# EAGLE design 2 Motors (EAGLE 9.6.2)
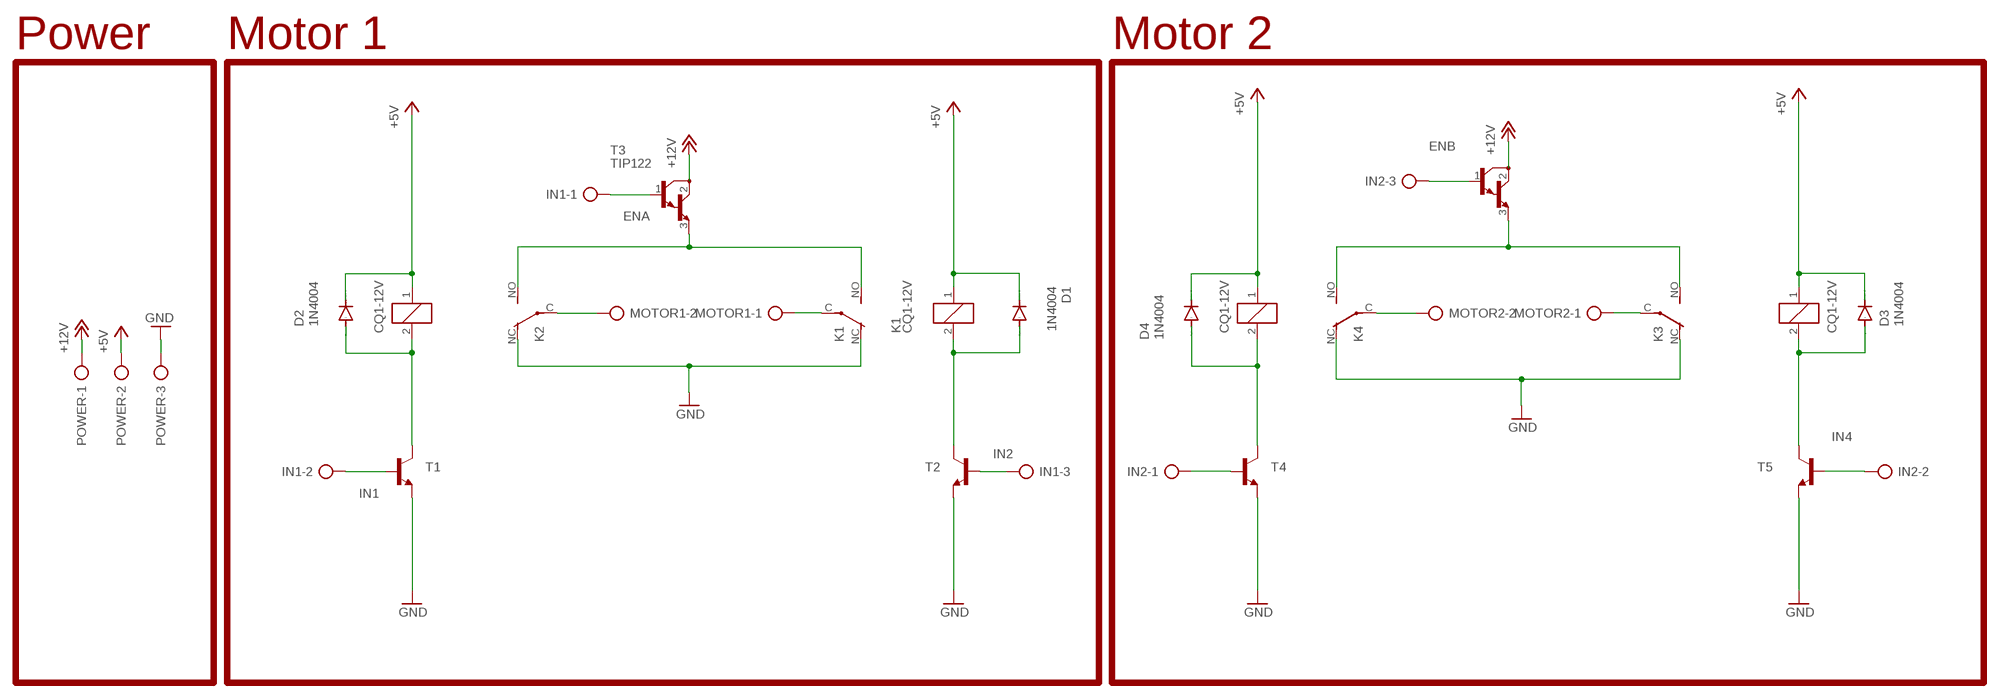
[diagram p0: schematic, sheet 1]

## Parts
D1  1N4004  [DO41-10]
D2  1N4004  [DO41-10]
D3  1N4004  [DO41-10]
D4  1N4004  [DO41-10]
IN1  AK300/3  [AK300/3]
IN2  AK300/3  [AK300/3]
K1  CQ1-12V  [CQ1]
K2  CQ1-12V  [CQ1]
K3  CQ1-12V  [CQ1]
K4  CQ1-12V  [CQ1]
MOTOR1  AK300/2  [AK300/2]
MOTOR2  AK300/2  [AK300/2]
POWER  AK300/3  [AK300/3]
T1  2N2222-NPN-TO92-EBC  [TO92-EBC]
T2  2N2222-NPN-TO92-EBC  [TO92-EBC]
T3  TIP122  [TO220]
T4  2N2222-NPN-TO92-EBC  [TO92-EBC]
T5  2N2222-NPN-TO92-EBC  [TO92-EBC]
T6  TIP122  [TO220]

## Nets
+5V: D1.C D2.C D3.C D4.C K1.1 K2.1 K3.1 K4.1 POWER.2
+12V: POWER.1 T3.2(C) T6.2(C)
ENA: IN1.1 T3.1(B)
ENB: IN2.3 T6.1(B)
GND: K1.NC(2:O) K2.NC(2:O) K3.NC(2:O) K4.NC(2:O) POWER.3 T1.E T2.E T4.E T5.E
IN1: IN1.2 T1.B
IN2: IN1.3 T2.B
IN3: IN2.1 T4.B
IN4: IN2.2 T5.B
N$1: K2.C(2:P) MOTOR1.2
N$2: K1.NO(2:S) K2.NO(2:S) T3.3(E)
N$3: D2.A K2.2 T1.C
N$5: K1.C(2:P) MOTOR1.1
N$6: D1.A K1.2 T2.C
N$7: D3.A K3.2 T5.C
N$8: K3.NO(2:S) K4.NO(2:S) T6.3(E)
N$9: D4.A K4.2 T4.C
N$14: K3.C(2:P) MOTOR2.1
N$16: K4.C(2:P) MOTOR2.2

## Notes on the sheet
- Power | Motor 1 | Motor 2

## Library data of the parts
D1-D4 = diode:1N4004: DIODE general purpose rectifier, 1 A
IN1 IN2 POWER = con-ptr500:AK300/3: CONNECTOR; OC_FARNELL: unknown; OC_NEWARK: unknown
K1-K4 = relay:CQ1-12V: AUTOMOTIVE QUIET RELAY NAiS Source: http://www.mew-europe.com/.. en_ds_61208_0000.pdf; OC_FARNELL: unknown; OC_NEWARK: unknown
MOTOR1 MOTOR2 = con-ptr500:AK300/2: CONNECTOR; OC_FARNELL: unknown; OC_NEWARK: unknown
T1 T2 T4 T5 = transistor-neu-to92:*-NPN-: NPN Transistror
T3 T6 = transistor:TIP122: NPN BIPOLAR DARLINGTON TRANSISTOR

## Board
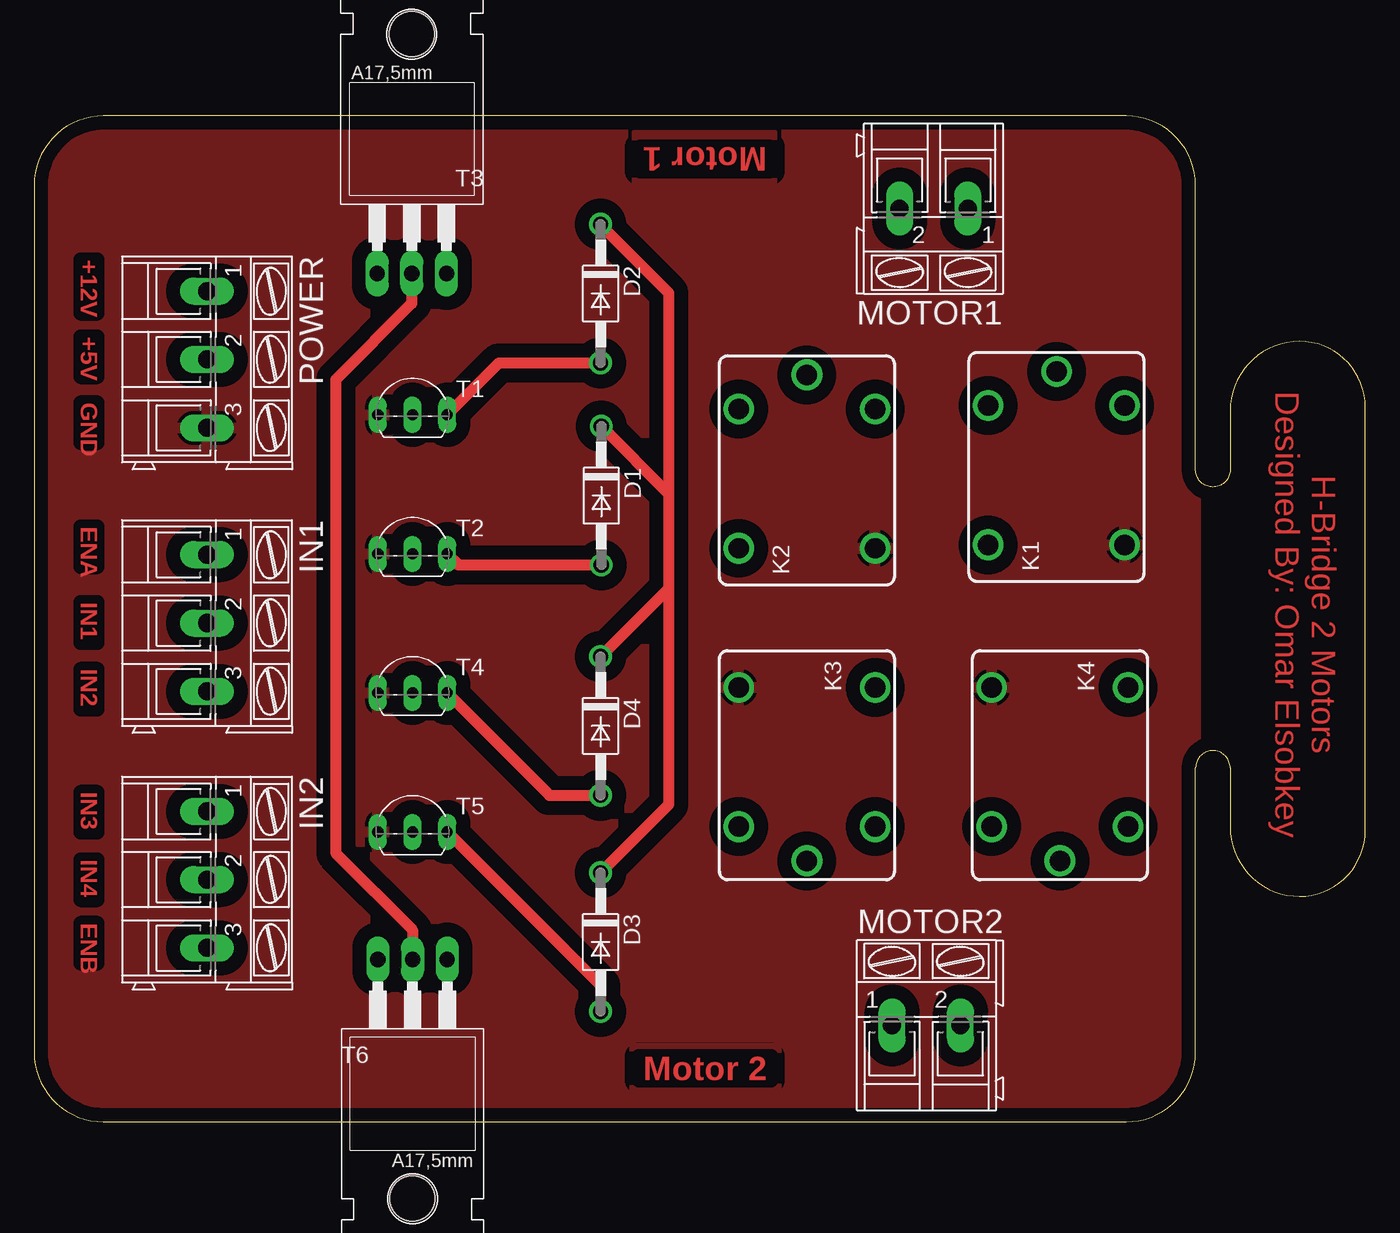
[diagram p1: board, top side]
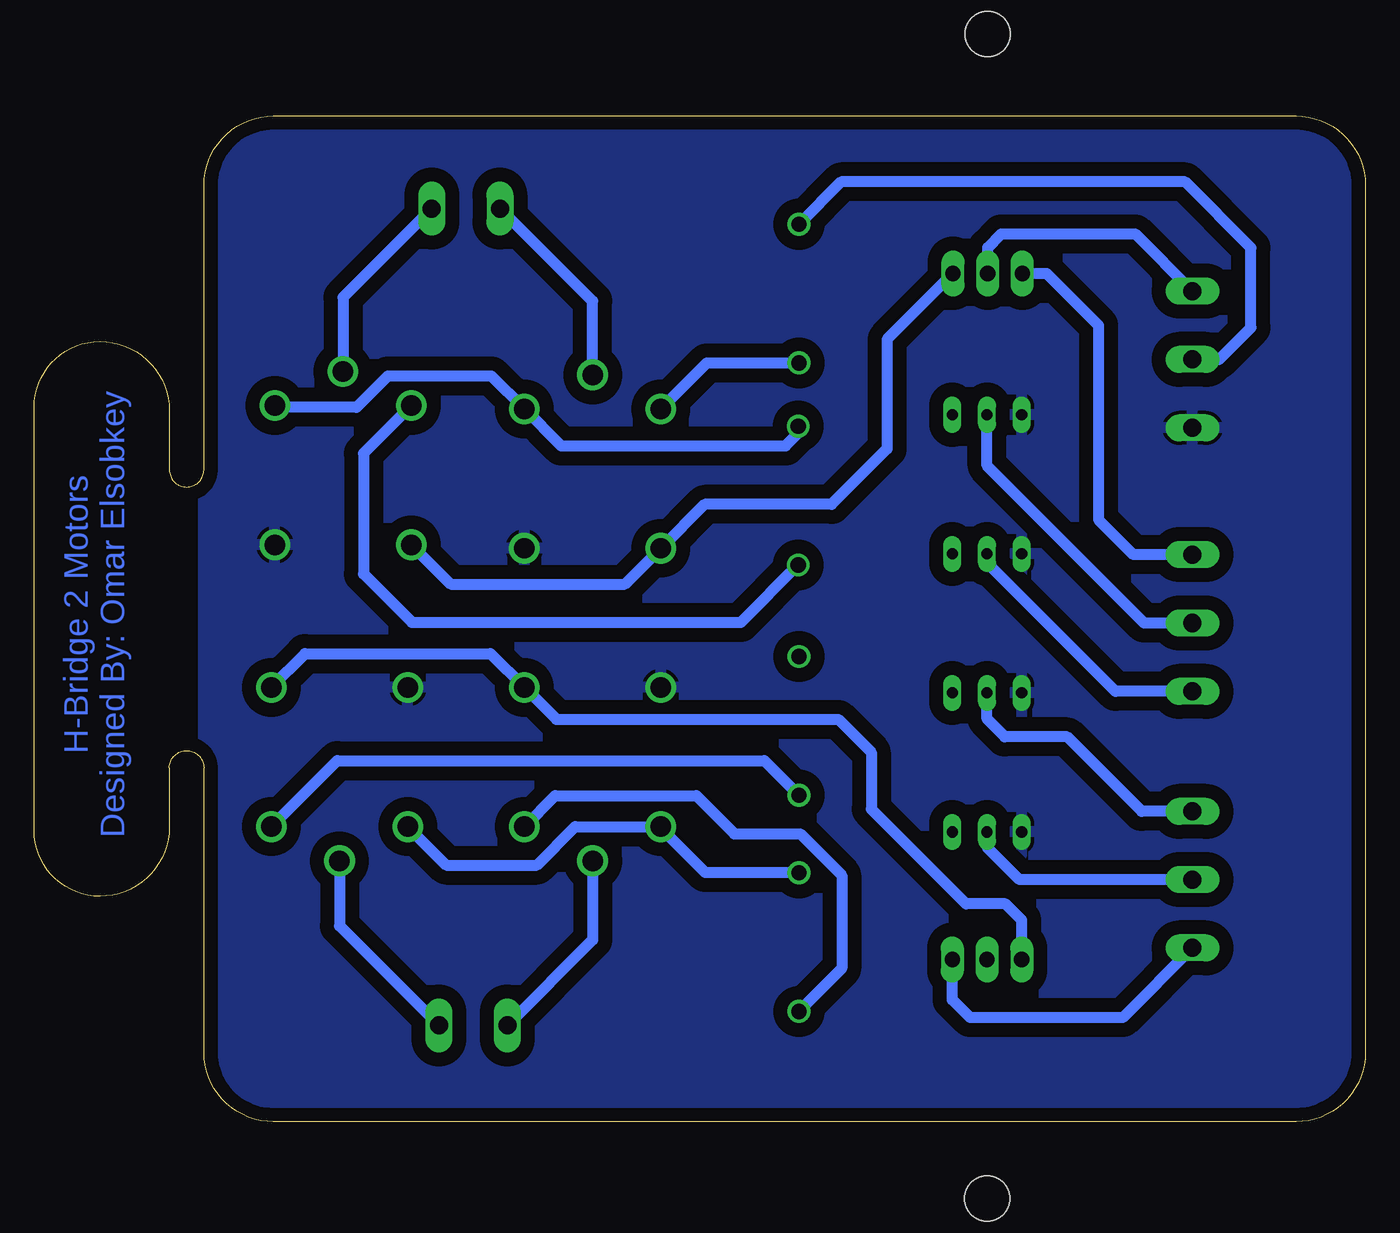
[diagram p2: board, bottom side, seen from below]

Size 97.54 x 73.66 mm. Coordinates in mm from the lower left corner, seen from the top.
Outline: 92.71,16.51 arc90 97.54,21.34 97.54,52.32 arc90 92.71,57.15 arc90 87.63,52.07 87.63,47.75 arc-90 86.36,46.48 arc-90 85.09,47.75 85.09,68.58 arc90 80.01,73.66 5.08,73.66 arc90 0,68.58 0,5.08 arc90 5.08,0 80.01,0 arc90 85.09,5.08 85.09,25.91 arc-90 86.36,27.18 arc-90 87.63,25.91 87.63,21.59 arc90 92.71,16.51
Copper layers (1*16): Top 0.035mm / dielectric 1.5mm / Bottom 0.035mm
Design rules "default *": minimum track width 32mil, minimum drill 0.35mm, track to track 16mil, track to pad 16mil, pad to pad 6mil, via to via 6mil, smd to smd 6mil, copper to edge 40mil, drill to drill 6mil, minimum pad ring 10mil, minimum via ring 8mil, stop-mask expansion 4mil, vias tented up to drill 0mil, thermal gap 10mil

### Footprints (pad centres in the part's own frame; a part is rotated, then mirrored left to right if it is on the bottom)
DO41-10 = drill 1.118: A 5.08,0; C -5.08,0
AK300/3 = drill 1.321 long: 1 -5.004,0; 2 0,0; 3 5.004,0
CQ1 = drill 1.5: 1 4.5,-5; 2 4.5,5; C 7,0; NC -5.7,-5; NO -5.7,5
AK300/2 = drill 1.321 long: 1 -2.515,0; 2 2.489,0
TO92-EBC = drill 0.813 long: B 0,-1.27; C 2.54,-1.27; E -2.54,-1.27
TO220 = drill 1.118 long: 1 -2.54,-6.35; 2 0,-6.35; 3 2.54,-6.35 | hole 3.302: 0,11.176

### Placement (x,y rotation side)
D1  41.55,45.86 270 top
D2  41.5,60.66 270 top
D3  41.5,13.16 270 top
D4  41.5,28.99 270 top
IN1  12.67,36.53 270 top
IN2  12.67,17.73 270 top
K1  74.9,47.96 90 top
K2  56.62,47.7 90 top
K3  56.62,26.11 270 top
K4  75.16,26.11 270 top
MOTOR1  65.89,66.88 180 top
MOTOR2  65.38,7.06 0 top
POWER  12.67,55.83 270 top
T1  27.72,53.05 0 top
T2  27.72,42.86 0 top
T3  27.67,68.48 0 top
T4  27.72,32.68 0 top
T5  27.72,22.49 0 top
T6  27.72,5.54 180 top

### Tracks (layer width: path | path; a pad name or v marks a point on that pad's centre or on a via)
+5V
  Top 0.813: D2.C 41.5,65.68 46.48,60.71 46.48,46.01 | 46.48,46.01 46.48,39.05 | 46.48,39.05 46.48,23.22 D3.C | D1.C 46.48,46.01 | D4.C 46.48,39.05
  Bottom 0.813: D1.C 41.55,50.43 42.48,49.5 58.92,49.5 K2.1 64.03,54.61 71.63,54.61 73.91,52.32 79.77,52.32 K1.1 | K4.1 67.34,18.8 60.71,18.8 57.89,21.61 K3.1 51.62,21.49 48.36,18.24 D3.C | POWER.2 10.72,55.83 8.38,58.17 8.38,64.01 13.21,68.83 38.41,68.83 D2.C
+12V
  Top 0.813: T3.2 27.67,59.93 22.1,54.36 22.1,19.67 27.72,14.04 T6.2
  Bottom 0.813: T3.2 27.67,64.02 26.67,65.02 16.87,65.02 POWER.1
ENA
  Bottom 0.813: T3.1 23.36,62.13 19.56,58.33 19.56,44.09 16.99,41.53 IN1.1
ENB
  Bottom 0.813: IN2.3 17.78,7.62 28.96,7.62 30.26,8.93 T6.1
GND
  pour Bottom (isolate 1.016): -2.26,74.96 85.14,74.96 85.14,-1.96 -2.26,-1.96
  pour Top (isolate 1.016): -0.84,73.91 85.09,73.91 85.09,-1.4 -0.84,-1.4
IN1
  Bottom 0.813: IN1.2 16.2,36.52 27.72,48.04 T1.B
IN2
  Bottom 0.813: IN1.3 18.31,31.52 27.72,40.93 T2.B
IN3
  Bottom 0.813: IN2.1 16.38,22.73 21.84,28.19 26.42,28.19 27.72,29.5 T4.B
IN4
  Bottom 0.813: IN2.2 25.35,17.73 27.72,20.1 T5.B
N$1
  Bottom 0.813: K2.C 56.62,60.1 MOTOR1.2
N$2
  Bottom 0.813: K1.NO 67.02,39.37 54.25,39.37 K2.NO 48.41,45.21 39.12,45.21 35.05,49.28 35.05,57.29 T3.3
N$3
  Top 0.813: T1.C 34.06,55.58 D2.A
  Bottom 0.813: K2.2 48.24,55.58 D2.A
N$5
  Bottom 0.813: MOTOR1.1 74.91,60.38 K1.C
N$6
  Top 0.813: T2.C 31.08,40.77 D1.A
  Bottom 0.813: K1.2 73.41,48.95 73.41,40.13 69.85,36.58 45.75,36.58 D1.A
N$7
  Top 0.813: T5.C 41.5,9.98 D3.A
  Bottom 0.813: K3.2 59.35,23.88 49.02,23.88 46.23,21.08 41.4,21.08 38.35,18.03 38.35,11.23 D3.A
N$8
  Bottom 0.813: K4.NO 77.68,34.29 64.09,34.29 K3.NO 59.27,29.46 38.61,29.46 36.2,27.05 36.2,22.9 29.25,15.96 26.37,15.96 25.18,14.77 T6.3
N$9
  Top 0.813: T4.C 37.76,23.91 D4.A
  Bottom 0.813: K4.2 75.32,26.45 44.04,26.45 D4.A
N$14
  Bottom 0.813: K3.C 56.62,13.31 MOTOR2.1
N$16
  Bottom 0.813: K4.C 75.16,14.35 MOTOR2.2
NAMES
  pour Top (isolate 0.508): 1.5,64.69 6.48,64.69 6.48,10.11 1.5,10.11
NAMES1
  pour Top (isolate 0.508): 43.99,72.47 54.25,72.47 54.25,68.45 43.99,68.45
NAMES2
  pour Top (isolate 0.508): 43.81,1.33 54.56,1.33 54.56,5.56 43.81,5.56

### Text on the board
Top: Motor 1 | +12V | +5V | GND | ENA | IN1 | H-Bridge 2 Motors / Designed By: Omar Elsobkey | IN2 | IN3 | IN4 | ENB | Motor 2
Bottom: H-Bridge 2 Motors / Designed By: Omar Elsobkey